# Altium schematic sheet Блок3.SchDoc
size A3; DocumentNumber: 7; SheetNumber: 7; SheetTotal: 12
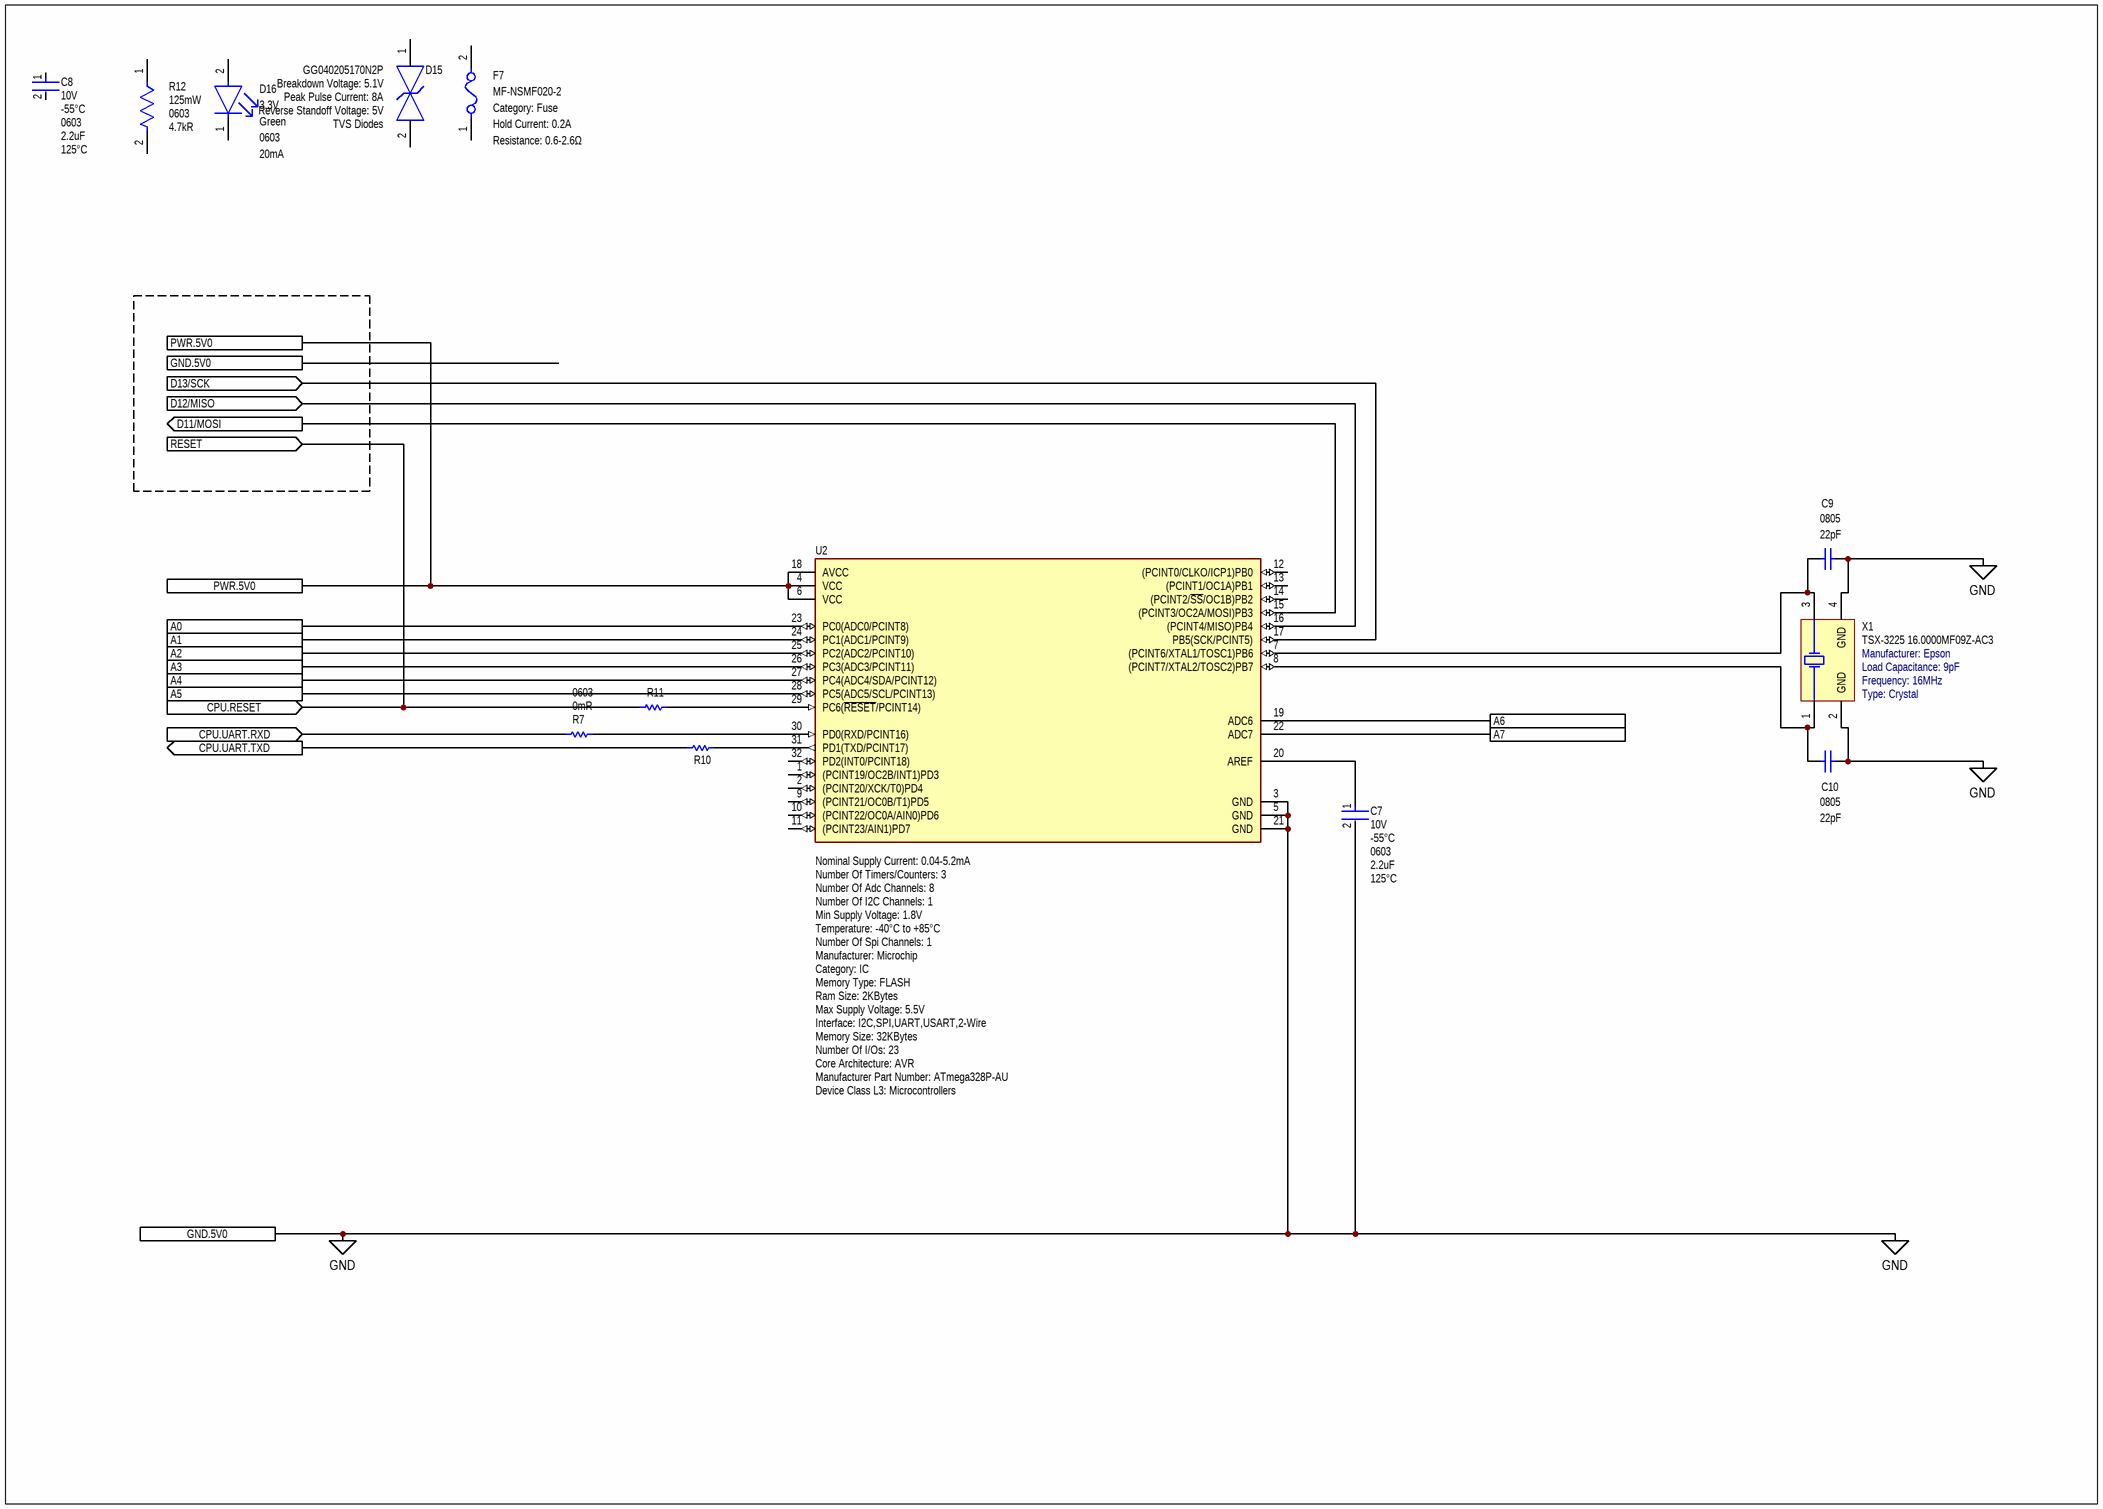
[diagram p0: Блок3.SchDoc]

## Parts
C7  Voltage Rating: 10V  Min Operating Temperature: -55°C  Case Code (Imperial): 0603  Capacitance: 2.2uF  Max Operating Temperature: 125°C  [FP-CL10-IPC_A]  (hidden comment: CL10B225KP8NFNC)
C8  Voltage Rating: 10V  Min Operating Temperature: -55°C  Case Code (Imperial): 0603  Capacitance: 2.2uF  Max Operating Temperature: 125°C  [FP-CL10-IPC_A]  (hidden comment: CL10B225KP8NFNC)
C9  Case/Package: 0805  Capacitance: 22pF  [CAPC2013X145X50ML20T20]  (hidden comment: VJ0805A220GXXCW1BC)
C10  Case/Package: 0805  Capacitance: 22pF  [CAPC2013X145X50ML20T20]  (hidden comment: VJ0805A220GXXCW1BC)
D15  GG040205170N2P  Breakdown Voltage: 5.1V  Peak Pulse Current: 8A  Reverse Standoff Voltage: 5V  Device Class L2: TVS Diodes  [FP-GG0402-IPC_A]
D16  Forward Voltage: 3.3V  Color: Green  Case/Package: 0603  Forward Current: 20mA  [FP-APT1608ZGCK-MFG]  (hidden comment: APT1608ZGCK)
F7  MF-NSMF020-2  Category: Fuse  Hold Current: 0.2A  Resistance: 0.6-2.6Ω  [FP-MF-NSMF020-2-MFG]
R7  PackageReference: 0603  Resistance: 0mR  [RESC1609X50X30NL8T20]  (hidden comment: CRCW06030000Z0EA)
R10  CRCW06030000Z0EA  [RESC1609X50X30NL8T20]  (value not drawn)
R11  CRCW06030000Z0EA  [RESC1609X50X30NL8T20]  (value not drawn)
R12  Power Rating: 125mW  Case/Package: 0603  Resistance: 4.7kR  [FP-MCT0603-MFG]  (hidden comment: MCT06030C4701FP500)
U2  Nominal Supply Current: 0.04-5.2mA  Number Of Timers/Counters: 3  Number Of Adc Channels: 8  Number Of I2C Channels: 1  Min Supply Voltage: 1.8V  Temperature: -40°C to +85°C  Manufacturer: Microchip  Category: IC  Memory Type: FLASH  Ram Size: 2KBytes  Max Supply Voltage: 5.5V  Interface: I2C,SPI,UART,USART,2-Wire  Memory Size: 32KBytes  Number Of I/Os: 23  Core Architecture: AVR  Device Class L3: Microcontrollers  [FP-32A-IPC_A]  (hidden comment: ATmega328P-AU)
X1  TSX-3225 16.0000MF09Z-AC3  Manufacturer: Epson  Load Capacitance: 9pF  Frequency: 16MHz  Type: Crystal  [EPSON-TSX-3225_V]

## Ports
A0, A1, A2, A3, A4, A5, A6, A7, CPU.RESET (in), CPU.UART.RXD (in), CPU.UART.TXD (out), D11/MOSI (out), D12/MISO (in), D13/SCK (in), GND.5V0, PWR.5V0, RESET (in)

## Nets
GND: C7.2 C9.2 C10.2 U2.3(GND) U2.5(GND) U2.21(GND) X1.2(GND) X1.4(GND) ; port GND.5V0
A0: U2.23(PC0(ADC0/PCINT8)) ; port A0
A1: U2.24(PC1(ADC1/PCINT9)) ; port A1
A2: U2.25(PC2(ADC2/PCINT10)) ; port A2
A3: U2.26(PC3(ADC3/PCINT11)) ; port A3
A4: U2.27(PC4(ADC4/SDA/PCINT12)) ; port A4
A5: U2.28(PC5(ADC5/SCL/PCINT13)) ; port A5
A6: U2.19(ADC6) ; port A6
A7: U2.22(ADC7) ; port A7
CPU.RESET: R11.1 ; port CPU.RESET, port RESET
CPU.UART.RXD: R7.1 ; port CPU.UART.RXD
CPU.UART.TXD: R10.1 ; port CPU.UART.TXD
D11/MOSI: U2.15((PCINT3/OC2A/MOSI)PB3) ; port D11/MOSI
D12/MISO: U2.16((PCINT4/MISO)PB4) ; port D12/MISO
D13/SCK: U2.17(PB5(SCK/PCINT5)) ; port D13/SCK
PWR.5V0: U2.4(VCC) U2.6(VCC) U2.18(AVCC) ; port PWR.5V0
NetC7_1: C7.1 U2.20(AREF)
NetC9_1: C9.1 U2.7((PCINT6/XTAL1/TOSC1)PB6) X1.3(X2)
NetC10_1: C10.1 U2.8((PCINT7/XTAL2/TOSC2)PB7) X1.1(X1)
NetR7_2: R7.2 U2.30(PD0(RXD/PCINT16))
NetR10_2: R10.2 U2.31(PD1(TXD/PCINT17))
NetR11_2: R11.2 U2.29(PC6(~{RESET}/PCINT14))

Not connected (* = marked no-connect by the designer): C8 1 2; D15 1 2; D16 1(C) 2(A); F7 1 2; R12 1 2; U2 1((PCINT19/OC2B/INT1)PD3) 2((PCINT20/XCK/T0)PD4) 9((PCINT21/OC0B/T1)PD5) 10((PCINT22/OC0A/AIN0)PD6) 11((PCINT23/AIN1)PD7) 12((PCINT0/CLKO/ICP1)PB0) 13((PCINT1/OC1A)PB1) 14((PCINT2/~{SS}/OC1B)PB2) 32(PD2(INT0/PCINT18))

## Library data of the parts
C7 C8 = CMP-13271-000561-1: Cap Ceramic 2.2uF 10V X7R ±10% Pad SMD 0603 +125°C T/R; Thickness: 0.035inch; Radiation Hardening: No; Mount: Surface Mount; Dielectric: X7R; Case Code (Metric): 1608; Package Quantity: 1; Width: 0.031inch; Case/Package: 0603; Height: 0.8mm; Depth: 0.8mm; Packaging: Tape and Reel; Length: 0.063inch; Tolerance: 10%
C9 C10 = CMP-1036-01227-2: Manufacturer: Vitramon; Dielectric Material: Tantalum; Voltage Rating (DC): 25V; Tolerance: 2%; Dielectric: C0G; Part Number: VJ0805A220GXXCW1BC; Supplier 1: Arrow Electronics; Supplier Part Number 1: VJ0805A220GXXCW1BC; Manufacturer Part Number: VJ0805A220GXXCW1BC; RoHS: Yes; Category: Ceramic Capacitors; Stock 1: 15327; Pricing 1: 1=0,04260, 10=0,03960, 25=0,03920, 100=0,03760, 250=0,03590, 500=0,03430, 1000=0,03270, 3000=0,03100, 6000=0,02940, 15000=0,02780, 4000=0,03340 (USD); Mount: Surface Mount; Case Code (Imperial): 0805; Case Code (Metric): 2012; Weight: 0.000194oz; Min Operating Temperature: -55°C; Max Operating Temperature: 125°C; Packaging: Tape and Reel; Package Quantity: 4000; Termination: SMD/SMT; Construction: Flat; Series: VJ W1BC; Length: 2mm; Width: 1.25mm; Height: 1.45mm; Depth: 1.25mm; RoHS Compliant: Yes; Lead Free: Lead Free; ComponentLink1URL: https://datasheet.ciiva.com/11483/vjw1bcbascomseries-11483900.pdf?src-supplier=Avnet; ComponentLink1Description: https://datasheet.ciiva.com/11483/vjw1bcbascomseries-11483900.pdf?src-supplier=Avnet
D15 = CMP-04587-000002-1: TVS DIODE 5V 10V 0402; Manufacturer: AVX; Capacitance: 17pF; Peak Pulse Power: 80W; Value: 17pF; Number Of Channels: 1; Direction: Bidirectional; Manufacturer Part Number: GG040205170N2P; Temperature: -55°C to +125°C; Octopart: https://octopart.com/gg040205170n2p-avx-81066082; RoHS: TRUE; Clamping Voltage: 10V; Device Class L1: Circuit Protection; ComponentLink2Description: Datasheet; Category: Diode; Package: GG0402; Temperature Range High: +125°C; Digikey Description: TVS DIODE 5V 10V 0402; Ipc Land Pattern Name: DIOC10060X50; Device Class L3: unset; Automotive: No; Mouser Description: ESD Suppressor TVS Bi-Dir 5V 2-Pin Case 0402(1006Metric) T/R; ComponentLink2URL: http://datasheets.avx.com/AVX-GiGuard.pdf; Height: 0.55mm; Lead Free: Yes; Temperature Range Low: -55°C
D16 = CMP-44529-000024-1: LED GREEN CLEAR CHIP SMD; Dominant Wavelength: 525nm; Lens Color: Colorless; Viewing Angle: 120°; Luminous Intensity: 350mcd; Lens Transparency: Clear; Max Operating Temperature: 85°C; Mount: Surface Mount; Min Operating Temperature: -40°C; Case Code (Metric): 1608; Test Current: 20mA; Packaging: Tape and Reel; Width: 0.8mm; Package Quantity: 1; Height: 0.75mm; Length: 1.6mm; Illumination Color: Green; Lead Free: Lead Free; Case Code (Imperial): 0603
F7 = CMP-07400-000029-1: PTC RESET FUSE 24V 200MA 1206; Manufacturer: Bourns; Trip Current: 0.46A; Trip Time: 0.6s; Current Rating: 10A; Automotive Grade: Grade 3; Value: 0.6-2.6Ω; Voltage Rating: 24V; Ambient Temperature Range Low: -40°C; Device Class L1: Circuit Protection; Temperature Range Low: -40°C; Temperature: -40°C to +85°C; Temperature Range High: +85°C; Mouser Description: Resettable Fuses - PPTC 0.20A 24V 0.60ohm MAX (R); Device Class L3: unset; RoHS: TRUE; Package: MF-NSMF020-2; Ambient Temperature Range High: +85°C; ComponentLink2Description: Datasheet; Digikey Description: PTC RESET FUSE 24V 200MA 1206; Device Class L2: PTC Resettable Fuses; Manufacturer Part Number: MF-NSMF020-2; Octopart: https://octopart.com/mf-nsmf020-2-bourns-94649; Automotive: Yes; Height: 0.85mm; Lead Free: Yes; ComponentLink2URL: https://www.bourns.com/docs/Product-Datasheets/mfnsmf.pdf
R7 = CMP-2000-03816-5: Chip Resistor, 0 Ohm, Jumper, 100 mW, -55 to 155 degC, 0603 (1608 Metric), RoHS, Tape and Reel; Manufacturer: Vishay; Manufacturer Part Number: CRCW0603-0000Z0EA; Voltage Rating: 75V; Current Rating: 2A; Max Power Dissipation: 100mW; Temperature Coefficient: 100ppm/°C; Tolerance: 5%; Package Quantity: 5000; DatasheetVersion: 06/2012; Min Operating Temperature: -55°C; ComponentLink1URL: http://www.vishay.com/; Mounting Technology: Surface Mount; Height: 0.45mm; ComponentLink1Description: Manufacturer URL; REACH SVHC: Unknown; Packaging: Cut Tape; Max Operating Temperature: 155°C; Mount: Surface Mount; ComponentLink2Description: Datasheet; PackageDescription: 2-Pin Surface Mount Device, Body 1.575 x 0.85 mm; Length: 1.55mm; ComponentLink2URL: http://www.vishay.com/docs/20035/dcrcwe3.pdf; Pins: 2; RoHSCompliant: true; Case Code (Imperial): 0603; Case Code (Metric): 1608; Case/Package: 0603; Category: Chip SMD Resistors; Contact Plating: Tin,Lead; Depth: 0.85mm; Features: Automotive AEC-Q200; Lead Free: Lead Free; Military Standard: Not; Number of Terminations: 2; Power Rating: 100mW; Radiation Hardening: No; Resistor Type: Thick Film; Series: D/CRCW E3; Technology: THICK FILM; Termination: SMD/SMT; Voltage Rating (DC): 75V; Weight: 0.000917oz; Width: 0.85mm; Working Voltage: 75V
R10 R11 = CMP-2000-03816-5: Chip Resistor, 0 Ohm, Jumper, 100 mW, -55 to 155 degC, 0603 (1608 Metric), RoHS, Tape and Reel; Manufacturer: Vishay; Manufacturer Part Number: CRCW0603-0000Z0EA; Voltage Rating: 75V; Current Rating: 2A; Max Power Dissipation: 100mW; Resistance: 0mR; Temperature Coefficient: 100ppm/°C; Tolerance: 5%; Package Quantity: 5000; DatasheetVersion: 06/2012; Min Operating Temperature: -55°C; ComponentLink1URL: http://www.vishay.com/; Mounting Technology: Surface Mount; Height: 0.45mm; ComponentLink1Description: Manufacturer URL; REACH SVHC: Unknown; PackageReference: 0603; Packaging: Cut Tape; Max Operating Temperature: 155°C; Mount: Surface Mount; ComponentLink2Description: Datasheet; PackageDescription: 2-Pin Surface Mount Device, Body 1.575 x 0.85 mm; Length: 1.55mm; ComponentLink2URL: http://www.vishay.com/docs/20035/dcrcwe3.pdf; Pins: 2; RoHSCompliant: true; Case Code (Imperial): 0603; Case Code (Metric): 1608; Case/Package: 0603; Category: Chip SMD Resistors; Contact Plating: Tin,Lead; Depth: 0.85mm; Features: Automotive AEC-Q200; Lead Free: Lead Free; Military Standard: Not; Number of Terminations: 2; Power Rating: 100mW; Radiation Hardening: No; Resistor Type: Thick Film; Series: D/CRCW E3; Technology: THICK FILM; Termination: SMD/SMT; Voltage Rating (DC): 75V; Weight: 0.000917oz; Width: 0.85mm; Working Voltage: 75V
R12 = CMP-02407-001733-1: RES SMD 100 OHM 1% 1/8W 0603; Voltage Rating: 75V; Temperature Coefficient: 50ppm/°C; Length: 1.55mm; Composition: Thin Film; Mount: Surface Mount; Max Operating Temperature: 125°C; Width: 0.033inch; Radiation Hardening: No; Depth: 0.85mm; Military Standard: Not; Case Code (Imperial): 0603; Case Code (Metric): 1608; Contact Plating: Tin; Packaging: Tape and Reel; Tolerance: 1%; Lead Free: Lead Free; REACH SVHC: No SVHC; Max Power Dissipation: 125mW; Min Operating Temperature: -55°C; Package Quantity: 1; Number of Terminations: 2; Voltage Rating (DC): 75V; Height: 0.022inch
U2 = CMP-06276-000013-1: IC MCU 8BIT 32KB FLASH 32TQFP; Standoff Height: 0.05mm; Data Bus Width: 8bits; Frequency: 20MHz; Number Of Pwm Channels: 6; Number Of Spi Channels: 1; Digikey Description: IC MCU 8BIT 32KB FLASH 32TQFP; RoHS: TRUE; Package: 32A; ComponentLink2Description: Datasheet; Number Of Uart Channels: 1; Temperature Range High: +85°C; Octopart: https://octopart.com/atmega328p-au-microchip-77760215; Footprint Url: http://ww1.microchip.com/downloads/en/appnotes/atmel-8826-seeprom-pcb-mounting-guidelines-surface-mount-packages-applicationnote.pdf; Lead Free: Yes; Device Class L1: Integrated Circuits (ICs); Device Class L2: Embedded Processors and Controllers; Ipc Land Pattern Name: QFP80P900X900X120-32; Number Of A/D Converters: 1; Number Of Cores: 1; Automotive: No; Temperature Range Low: -40°C; Mouser Description: ATmega Series 32 KB Flash 2 KB SRAM 20 MHz 8-Bit Microcontroller - TQFP-32; ComponentLink2URL: http://ww1.microchip.com/downloads/en/DeviceDoc/ATmega48A-PA-88A-PA-168A-PA-328-P-DS-DS40002061A.pdf; Height: 1.2mm; Manufacturer Part Number: ATmega328P-AU
X1 = CMP-2000-07331-1: Crystal, 16 MHz, -40 to 85 degC, 4-Pin SMD, RoHS, Tape and Reel; ESR: 60Ohms; Brand: EpsonTiming; Frequency Stability: 10PPM; Unit Weight: 0.000564oz; Drive Level: 200uW; Factory Pack Quantity: 250; Mounting Style: SMD/SMT; Packaging: Reel; Datasheet URL: https://support.epson.biz/td/api/doc_check.php?dl=brief_FA-238V_en.pdf; Datasheet Version: 12/2015; Package Reference: TSX-3225; Series: TSX-3225; Package / Case: 3.2mmx2.5mm; Package Description: 4-Pin Surface Mount Device, Body 3.2 x 2.5 mm; Height: 0.6mm; Manufacturer URL: https://www.eea.epson.com/; Operating Temperature Range: -20Cto+75C; Length: 3.2mm; Width: 2.5mm; RoHS: True; Mounting Technology: SurfaceMount; Termination Style: SMD/SMT; Product Category: Crystals; Tolerance: 10PPM